# EAGLE design teensy-carrier (EAGLE 8.5.0)

## Sheet 1 of 2
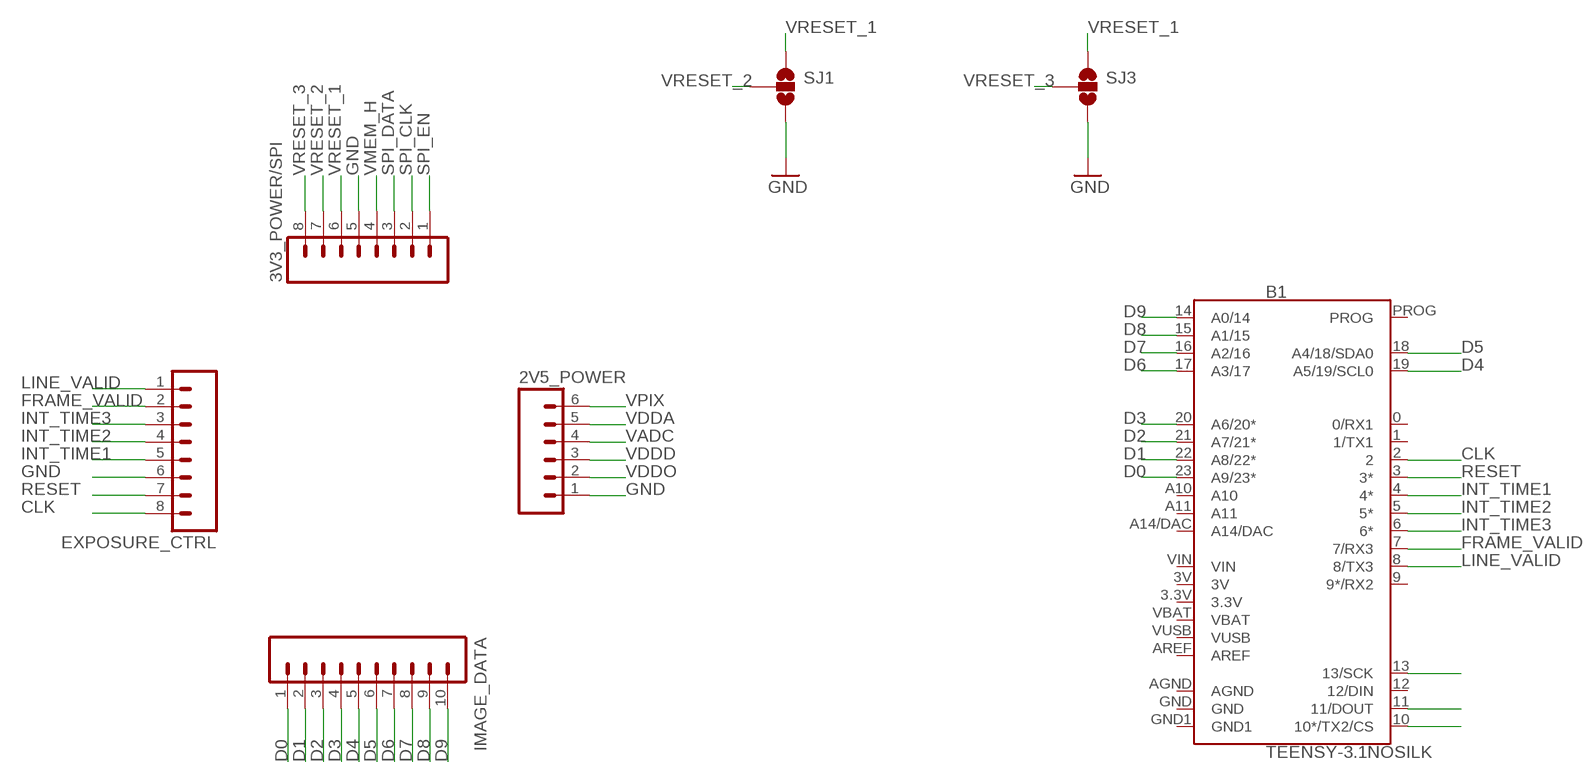
[diagram p0: schematic, sheet 1]

### Parts
2V5_POWER  M06SILK_FEMALE_PTH  [1X06]
3V3_POWER/SPI  M08  [1X08_ROUND]
B1  TEENSY-3.1NOSILK  [TEENSY-3.1_NOSILK]
EXPOSURE_CTRL  M08  [1X08_ROUND]
IMAGE_DATA  M10SILK_FEMALE_PTH  [1X10]
SJ1  SOLDERJUMPER_2WAYS  [SJ_3]
SJ3  SOLDERJUMPER_2WAYS  [SJ_3]

### Nets
CLK: B1.2 EXPOSURE_CTRL.8
D0: B1.23(A9/23*) IMAGE_DATA.1
D1: B1.22(A8/22*) IMAGE_DATA.2
D2: B1.21(A7/21*) IMAGE_DATA.3
D3: B1.20(A6/20*) IMAGE_DATA.4
D4: B1.19(A5/19/SCL0) IMAGE_DATA.5
D5: B1.18(A4/18/SDA0) IMAGE_DATA.6
D6: B1.17(A3/17) IMAGE_DATA.7
D7: B1.16(A2/16) IMAGE_DATA.8
D8: B1.15(A1/15) IMAGE_DATA.9
D9: B1.14(A0/14) IMAGE_DATA.10
FRAME_VALID: B1.7(7/RX3) EXPOSURE_CTRL.2
GND: 2V5_POWER.1 3V3_POWER/SPI.5 EXPOSURE_CTRL.6 SJ1.3 SJ3.3 ; also sheet 2
INT_TIME1: B1.4(4*) EXPOSURE_CTRL.5
INT_TIME2: B1.5(5*) EXPOSURE_CTRL.4
INT_TIME3: B1.6(6*) EXPOSURE_CTRL.3
LINE_VALID: B1.8(8/TX3) EXPOSURE_CTRL.1
RESET: B1.3(3*) EXPOSURE_CTRL.7
SPI_CLK: 3V3_POWER/SPI.2 B1.13(13/SCK)
SPI_DATA: 3V3_POWER/SPI.3 B1.11(11/DOUT)
SPI_EN: 3V3_POWER/SPI.1 B1.10(10*/TX2/CS)
VADC: 2V5_POWER.4 ; also sheet 2
VDDA: 2V5_POWER.5 ; also sheet 2
VDDD: 2V5_POWER.3 ; also sheet 2
VDDO: 2V5_POWER.2 ; also sheet 2
VMEM_H: 3V3_POWER/SPI.4 ; also sheet 2
VPIX: 2V5_POWER.6 ; also sheet 2
VRESET_1: 3V3_POWER/SPI.6 SJ1.1 SJ3.1 ; also sheet 2
VRESET_2: 3V3_POWER/SPI.7 SJ1.2
VRESET_3: 3V3_POWER/SPI.8 SJ3.2
Unconnected: B1.0(0/RX1) B1.1(1/TX1) B1.9(9*/RX2) B1.12(12/DIN) B1.A10 B1.A11 B1.A14/DAC B1.AREF B1.PROG

## Sheet 2 of 2
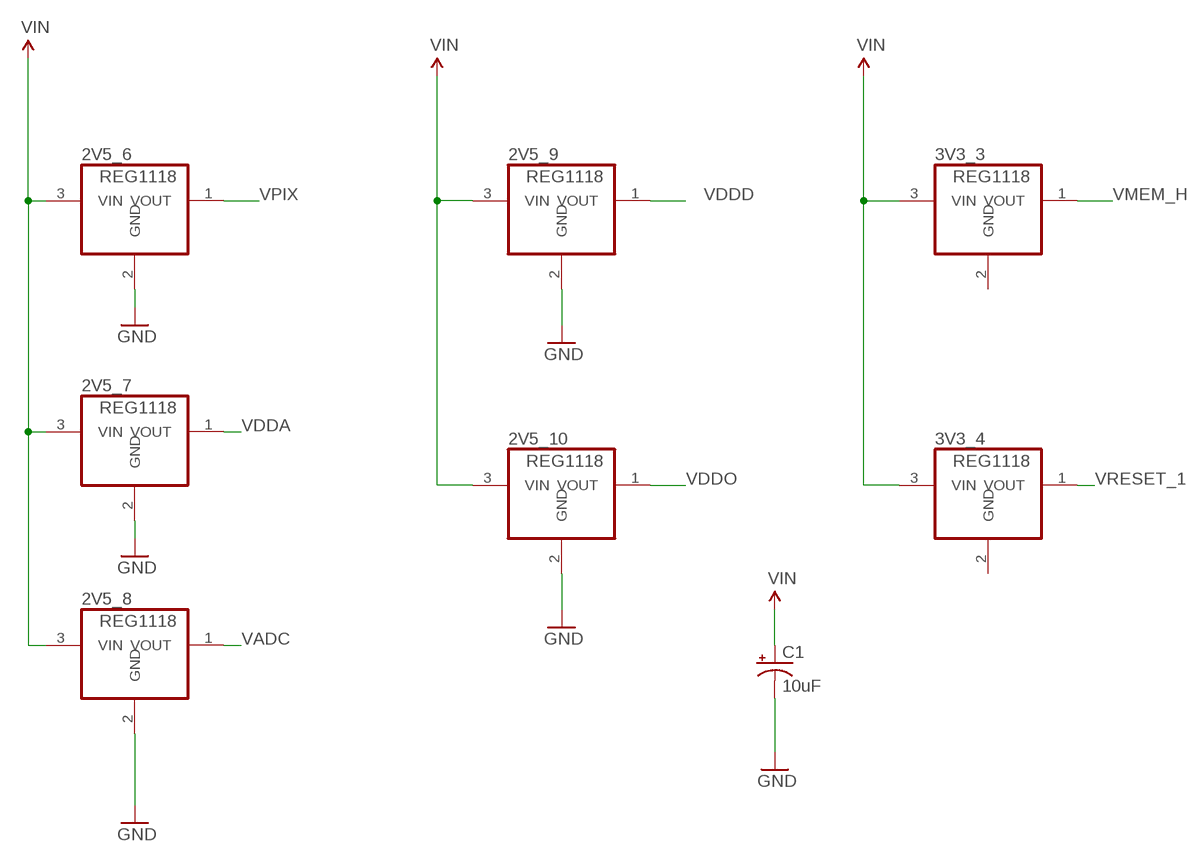
[diagram p1: schematic, sheet 2]

### Parts
2V5_6  REG1118  [SOT223]
2V5_7  REG1118  [SOT223]
2V5_8  REG1118  [SOT223]
2V5_9  REG1118  [SOT223]
2V5_10  REG1118  [SOT223]
3V3_3  REG1118  [SOT223]
3V3_4  REG1118  [SOT223]
C1  10uF  10UF-POLAR-EIA3216-16V-10%(TANT)  [EIA3216]

### Nets
GND: 2V5_6.2(GND) 2V5_7.2(GND) 2V5_8.2(GND) 2V5_9.2(GND) 2V5_10.2(GND) C1.- ; also sheet 1
VADC: 2V5_8.1(VOUT) ; also sheet 1
VDDA: 2V5_7.1(VOUT) ; also sheet 1
VDDD: 2V5_9.1(VOUT) ; also sheet 1
VDDO: 2V5_10.1(VOUT) ; also sheet 1
VIN: 2V5_6.3(VIN) 2V5_7.3(VIN) 2V5_8.3(VIN) 2V5_9.3(VIN) 2V5_10.3(VIN) 3V3_3.3(VIN) 3V3_4.3(VIN) C1.+
VMEM_H: 3V3_3.1(VOUT) ; also sheet 1
VPIX: 2V5_6.1(VOUT) ; also sheet 1
VRESET_1: 3V3_4.1(VOUT) ; also sheet 1

## Power pins joined to a net without a drawn wire
3.3V: B1.3.3V
3V: B1.3V
AGND: B1.AGND
GND: 3V3_3.2(GND) 3V3_4.2(GND) B1.GND
GND1: B1.GND1
VBAT: B1.VBAT
VIN: B1.VIN
VUSB: B1.VUSB

## Library data of the parts
2V5_6-2V5_10 3V3_3 3V3_4 = burr-brown:REG1118: 800mA Low Dropout (LDO) Positive Regulator with Current Source and Sink Capability; MPN: REG1118-2.85/2K5G4; OC_FARNELL: unknown; OC_NEWARK: 14M2185
2V5_POWER = SparkFun-Connectors:M06: Header 6 Standard 6-pin 0.1" header. Use with straight break away headers (SKU : PRT-00116), right angle break away headers (PRT-00553), swiss pins (PRT-00743), machine pins (PRT-00117), and female headers (PRT-00115). Molex polarized connector foot print use with SKU : PRT-08094 with associated crimp pins and housings. NOTES ON THE VARIANTS LOCK and LOCK_LONGPADS... This footprint was designed to help hold the alignment of a through-hole component (i.e. 6-pin header) while soldering it into place. You may notice that each hole has been shifted either up or down by 0.005 of an inch from it's more standard position (which is a perfectly straight line). This slight alteration caused the pins (the squares in the middle) to touch the edges of the holes. Because they are alternating, it causes a "brace" to hold the component in place. 0.005 has proven to be the perfect amount of "off-center" position when using our standard breakaway headers. Although looks a little odd when you look at the bare footprint, once you have a header in there, the alteration is very hard to notice. Also,if you push a header all the way into place, it is covered up entirely on the bottom side. This idea of altering the position of holes to aid alignment will be further integrated into the Sparkfun Library for other footprints. It can help hold any component with 3 or more connection pins.; PROD_ID: CONN-08437
3V3_POWER/SPI EXPOSURE_CTRL = SparkFun-Connectors:M08: Header 8 Standard 8-pin 0.1" header. Use with straight break away headers (SKU : PRT-00116), right angle break away headers (PRT-00553), swiss pins (PRT-00743), machine pins (PRT-00117), and female headers (PRT-00115).; PROD_ID: CONN-08437
B1 = SparkFun-Boards:TEENSY-3.1: Teensy 3+ Footprint Mechanical footprint with connectors for Teensy Development Board with ARM Cortex. SparkFun Products: Teensy 3.2 <https://www.sparkfun.com/products/13736> Teensy LC <https://www.sparkfun.com/products/13305>; SF_ID: DEV-12646
C1 = SparkFun-Capacitors:10UF-POLAR: 10.0µF polarized capacitors A capacitor is a passive two-terminal electrical component used to store electrical energy temporarily in an electric field.; PROD_ID: CAP-00811
IMAGE_DATA = SparkFun-Connectors:M10: Header 10 Standard 10-pin 0.1" header. Use with straight break away headers (SKU : PRT-00116), right angle break away headers (PRT-00553), swiss pins (PRT-00743), machine pins (PRT-00117), and female headers (PRT-00115).; PROD_ID: CONN-11563
SJ1 SJ3 = SparkFun-Retired:SOLDERJUMPER_2WAY: Solder Jumper 2 way solder jumper

## Board
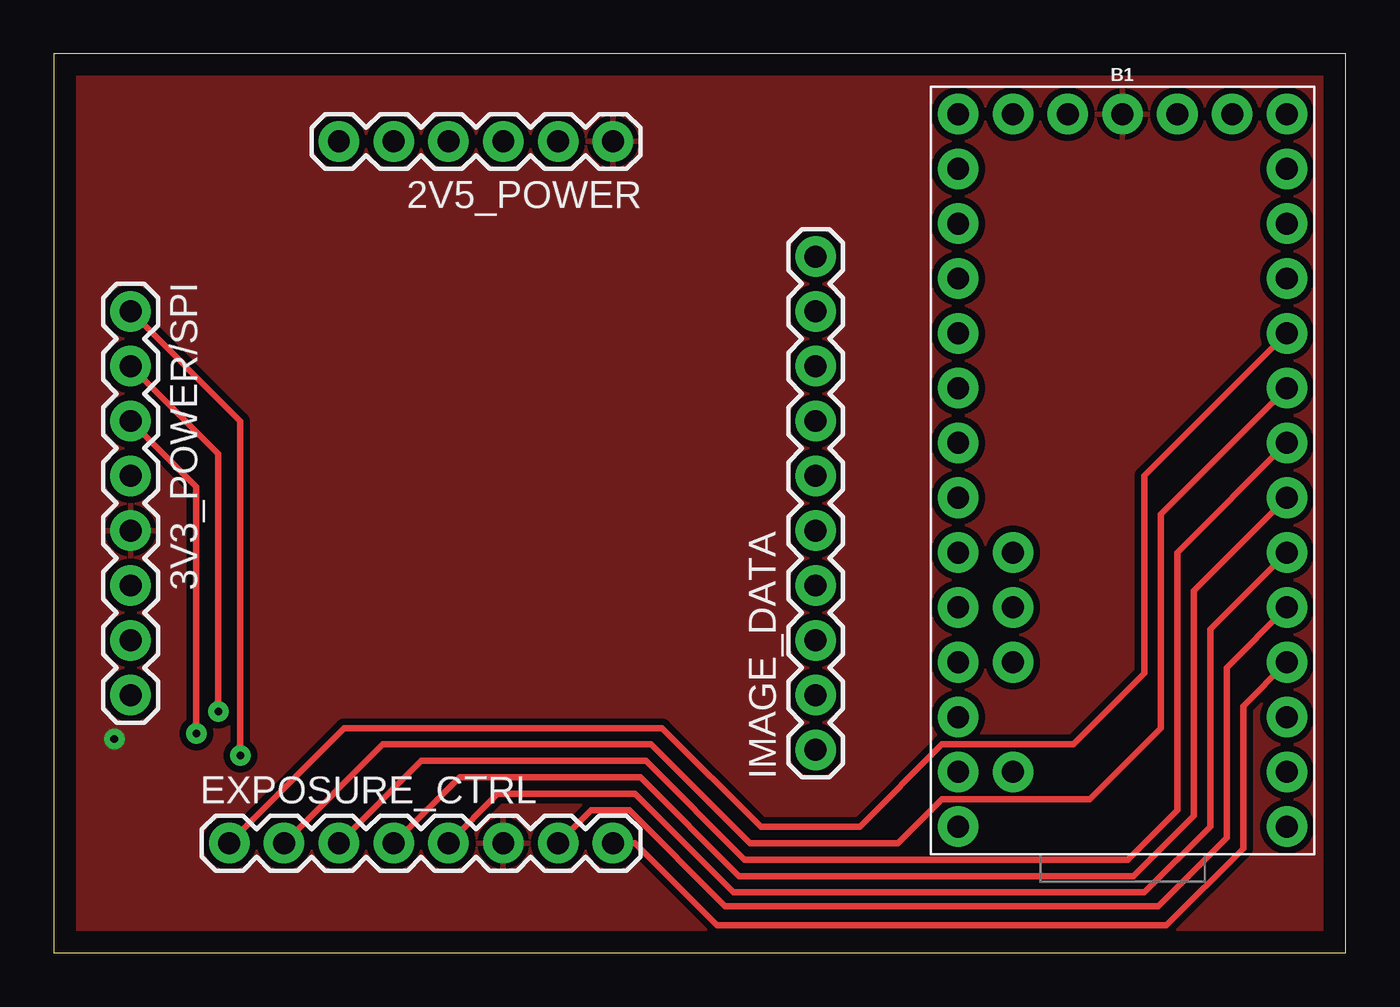
[diagram p2: board, top side]
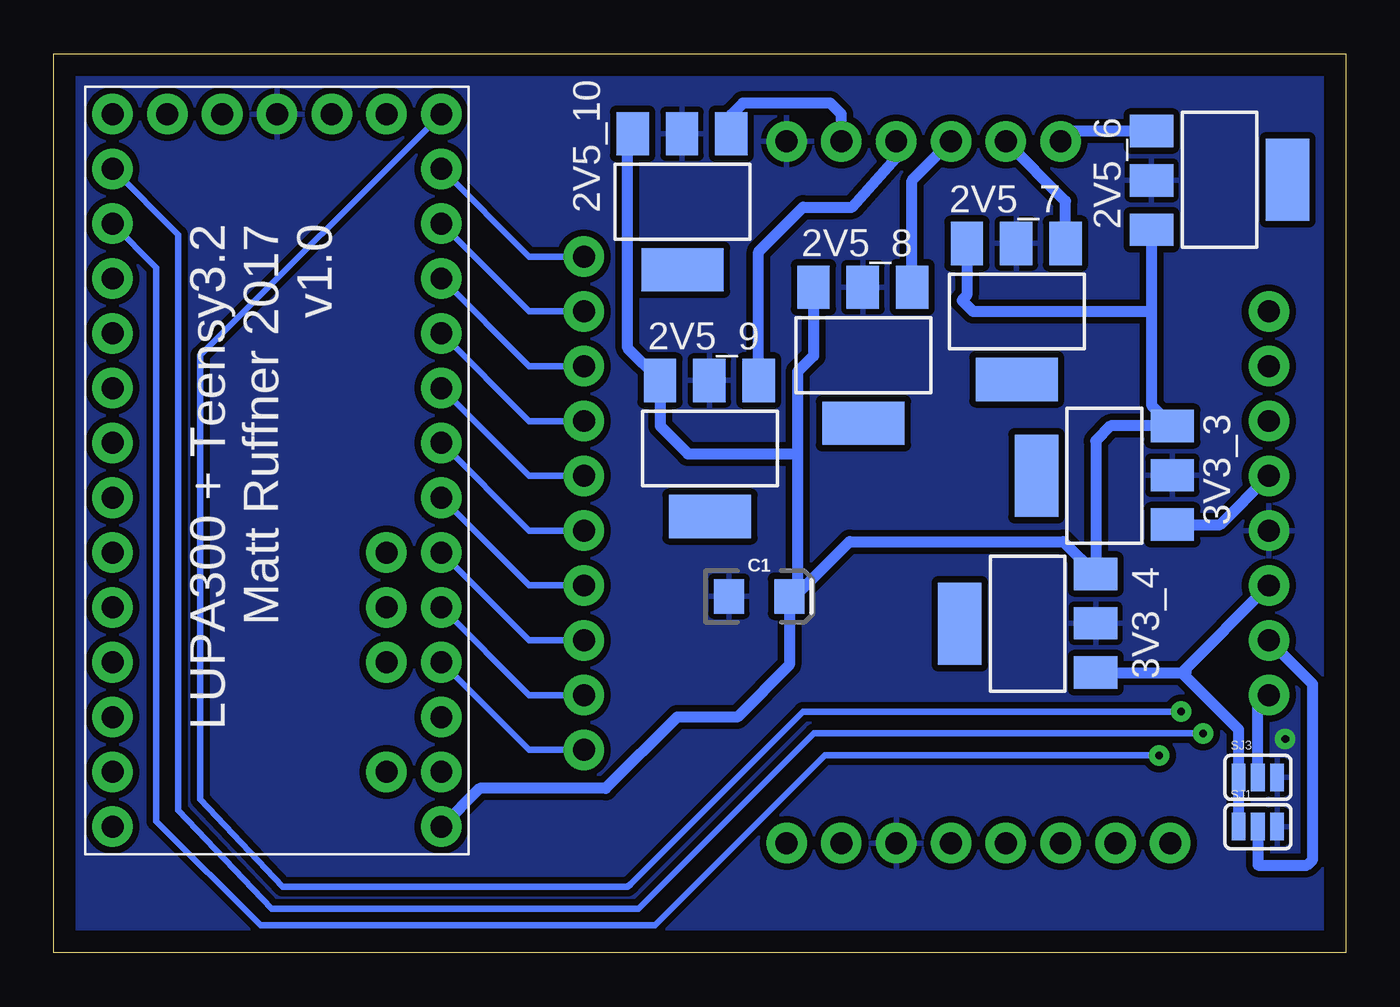
[diagram p3: board, bottom side, seen from below]

Size 59.87 x 41.65 mm. Coordinates in mm from the lower left corner, seen from the top.
Outline: 0,0 59.87,0 59.87,41.65 0,41.65 0,0
Copper layers (1*16): Top 0.035mm / dielectric 1.5mm / Bottom 0.035mm
Design rules "default": minimum track width 6mil, minimum drill 0.35mm, track to track 6mil, track to pad 6mil, pad to pad 6mil, via to via 6mil, smd to smd 6mil, copper to edge 40mil, drill to drill 6mil, minimum pad ring 10mil, minimum via ring 8mil, stop-mask expansion 4mil, vias tented up to drill 0mil, thermal gap 10mil

### Footprints (pad centres in the part's own frame; a part is rotated, then mirrored left to right if it is on the bottom)
SOT223 = smd 1.499 x 2.007: 1 -2.261,-3.15; 2 0.025,-3.15; 3 2.311,-3.15 | smd 3.81 x 2.007: 4 0,3.15
1X06 = drill 1.016 pad 1.88: 1 0,0; 2 2.54,0; 3 5.08,0; 4 7.62,0; 5 10.16,0; 6 12.7,0
1X08_ROUND = drill 1.016 pad 1.88: 1 0,0; 2 2.54,0; 3 5.08,0; 4 7.62,0; 5 10.16,0; 6 12.7,0; 7 15.24,0; 8 17.78,0
TEENSY-3.1_NOSILK = drill 1.016 pad 1.88: 0 7.62,-13.97; 1 7.62,-11.43; 2 7.62,-8.89; 3 7.62,-6.35; 3.3V 2.54,16.51; 3V -7.62,-11.43; 4 7.62,-3.81; 5 7.62,-1.27; 6 7.62,1.27; 7 7.62,3.81; 8 7.62,6.35; 9 7.62,8.89; 10 7.62,11.43; 11 7.62,13.97; 12 7.62,16.51; 13 -7.62,16.51; 14 -7.62,13.97; 15 -7.62,11.43; 16 -7.62,8.89; 17 -7.62,6.35; 18 -7.62,3.81; 19 -7.62,1.27; 20 -7.62,-1.27; 21 -7.62,-3.81; 22 -7.62,-6.35; 23 -7.62,-8.89; A10 -5.08,-6.35; A11 -5.08,-3.81; A14/DAC -5.08,16.51; AGND -7.62,-13.97; AREF -5.08,-8.89; GND 0,16.51; GND1 7.62,-16.51; PROG -2.54,16.51; VBAT 5.08,16.51; VIN -7.62,-16.51; VUSB -5.08,-13.97
EIA3216 = smd 1.4 x 1.6: + 1.4,0; - -1.4,0
1X10 = drill 1.016 pad 1.88: 1 0,0; 2 2.54,0; 3 5.08,0; 4 7.62,0; 5 10.16,0; 6 12.7,0; 7 15.24,0; 8 17.78,0; 9 20.32,0; 10 22.86,0
SJ_3 = smd 0.635 x 1.27: 1 -0.889,0; 2 0,0; 3 0.889,0

### Placement (x,y rotation side)
2V5_6  5.84,35.81 270 bottom
2V5_7  15.24,29.72 180 bottom
2V5_8  22.35,27.69 180 bottom
2V5_9  29.46,23.37 180 bottom
2V5_10  30.73,34.8 180 bottom
2V5_POWER  25.91,37.59 180 top
3V3_3  11.18,22.1 90 bottom
3V3_4  14.73,15.24 90 bottom
3V3_POWER/SPI  3.56,29.72 270 top
B1  49.53,22.35 0 top
C1  27.18,16.51 0 bottom
EXPOSURE_CTRL  8.13,5.08 0 top
IMAGE_DATA  35.31,9.4 90 top
SJ1  4.06,5.84 0 bottom
SJ3  4.06,8.13 0 bottom

### Tracks (layer width: path | path; a pad name or v marks a point on that pad's centre or on a via)
CLK
  Top 0.305: EXPOSURE_CTRL.8 26.92,5.08 30.73,1.27 51.56,1.27 55.12,4.83 55.12,11.43 B1.2
D0
  Bottom 0.305: IMAGE_DATA.1 37.85,9.4 B1.23
D1
  Bottom 0.305: IMAGE_DATA.2 37.85,11.94 B1.22
D2
  Bottom 0.305: IMAGE_DATA.3 37.85,14.48 B1.21
D3
  Bottom 0.305: IMAGE_DATA.4 37.85,17.02 B1.20
D4
  Bottom 0.305: IMAGE_DATA.5 37.85,19.56 B1.19
D5
  Bottom 0.305: IMAGE_DATA.6 37.85,22.1 B1.18
D6
  Bottom 0.305: IMAGE_DATA.7 37.85,24.64 B1.17
D7
  Bottom 0.305: IMAGE_DATA.8 37.85,27.18 B1.16
D8
  Bottom 0.305: IMAGE_DATA.9 37.85,29.72 B1.15
D9
  Bottom 0.305: IMAGE_DATA.10 37.85,32.26 B1.14
FRAME_VALID
  Top 0.305: EXPOSURE_CTRL.2 15.24,9.65 27.69,9.65 32.26,5.08 39.12,5.08 41.15,7.11 48.01,7.11 51.31,10.41 51.31,20.32 B1.7
GND  (via drill 0.35 pad 0.95)
  other vias: 2.79,9.91
  pour Top (isolate 0.305): 0,41.66 59.94,41.66 59.94,0 0,0
  pour Bottom (isolate 0.305): 0,41.66 59.94,41.66 59.94,0 0,0
INT_TIME1
  Top 0.305: EXPOSURE_CTRL.5 20.57,7.37 26.92,7.37 31.5,2.79 50.55,2.79 53.59,5.84 53.59,14.99 B1.4
INT_TIME2
  Top 0.305: EXPOSURE_CTRL.4 18.8,8.13 27.18,8.13 31.75,3.56 50.04,3.56 52.83,6.35 52.83,16.76 B1.5
INT_TIME3
  Top 0.305: EXPOSURE_CTRL.3 17.02,8.89 27.43,8.89 32,4.32 49.78,4.32 52.07,6.6 52.07,18.54 B1.6
LINE_VALID
  Top 0.305: EXPOSURE_CTRL.1 13.46,10.41 28.19,10.41 32.77,5.84 37.36,5.84 41.17,9.65 47.24,9.65 50.55,12.95 50.55,22.1 B1.8
RESET
  Top 0.305: EXPOSURE_CTRL.7 24.89,6.6 26.67,6.6 31.11,2.16 51.18,2.16 54.36,5.33 54.36,13.21 B1.3
SPI_CLK  (via drill 0.35 pad 0.95)
  Top 0.305: 3V3_POWER/SPI.2 7.62,23.11 v7.62,11.18
  Bottom 0.305: B1.13 53.09,27.69 53.09,7.11 49.28,3.05 33.27,3.05 33.15,3.17 25.15,11.18 v7.62,11.18
SPI_DATA  (via drill 0.35 pad 0.95)
  Top 0.305: 3V3_POWER/SPI.3 6.6,21.59 v6.6,10.16
  Bottom 0.305: v6.6,10.16 24.64,10.16 32.77,2.03 49.78,2.03 54.1,6.6 54.1,33.27 B1.11
SPI_EN  (via drill 0.35 pad 0.95)
  Top 0.305: 3V3_POWER/SPI.1 8.64,24.64 v8.64,9.14
  Bottom 0.305: v8.64,9.14 24.13,9.14 32,1.27 50.29,1.27 55.12,6.1 55.12,31.75 B1.10
VADC
  Bottom 0.508: 2V5_8.1 20.09,35.79 2V5_POWER.4
VDDA
  Bottom 0.508: 2V5_7.1 12.98,34.82 2V5_POWER.5
VDDD
  Bottom 0.508: 2V5_9.1 27.2,32.49 25.15,34.54 22.86,34.54 20.83,36.83 2V5_POWER.3
VDDO
  Bottom 0.508: 2V5_POWER.2 23.37,38.86 23.88,39.37 27.94,39.37 28.47,38.84 2V5_10.1
VIN
  Bottom 0.508: 25.4,16.63 22.98,19.05 13.08,19.05 3V3_4.3 11.58,23.72 10.9,24.41 3V3_3.3 8.99,25.38 8.99,29.72 | 2V5_6.3 8.99,29.72 | 2V5_7.3 17.55,30.45 17.78,30.23 17.27,29.72 8.99,29.72 | 2V5_8.3 24.66,27.66 25.4,26.92 25.4,23.11 | 25.4,23.11 30.48,23.11 31.77,24.41 2V5_9.3 33.27,28.02 33.27,37.72 2V5_10.3 | B1.VIN 40.13,7.62 34.29,7.62 30.99,10.92 28.19,10.92 25.78,13.34 C1.+ 25.46,16.57 25.4,16.63 | 25.4,23.11 25.4,16.63
VMEM_H
  Bottom 0.508: 3V3_3.1 5.82,19.84 3V3_POWER/SPI.4
VPIX
  Bottom 0.508: 2V5_6.1 12.72,38.08 2V5_POWER.6
VRESET_1
  Bottom 0.508: 3V3_4.1 7.59,12.98 | 7.59,12.98 3V3_POWER/SPI.6 | 7.39,12.98 7.59,12.98 | SJ1.1 SJ3.1 4.95,10.34 7.59,12.98
VRESET_2
  Bottom 0.508: SJ1.2 4.06,4.06 1.78,4.06 1.52,4.32 1.52,12.45 3V3_POWER/SPI.7
VRESET_3
  Bottom 0.508: SJ3.2 4.06,11.43 3V3_POWER/SPI.8

### Text on the board
bNames: LUPA300 + Teensy3.2 / Matt Ruffner 2017 / v1.0